# EAGLE design thinks (EAGLE 8.2.2)
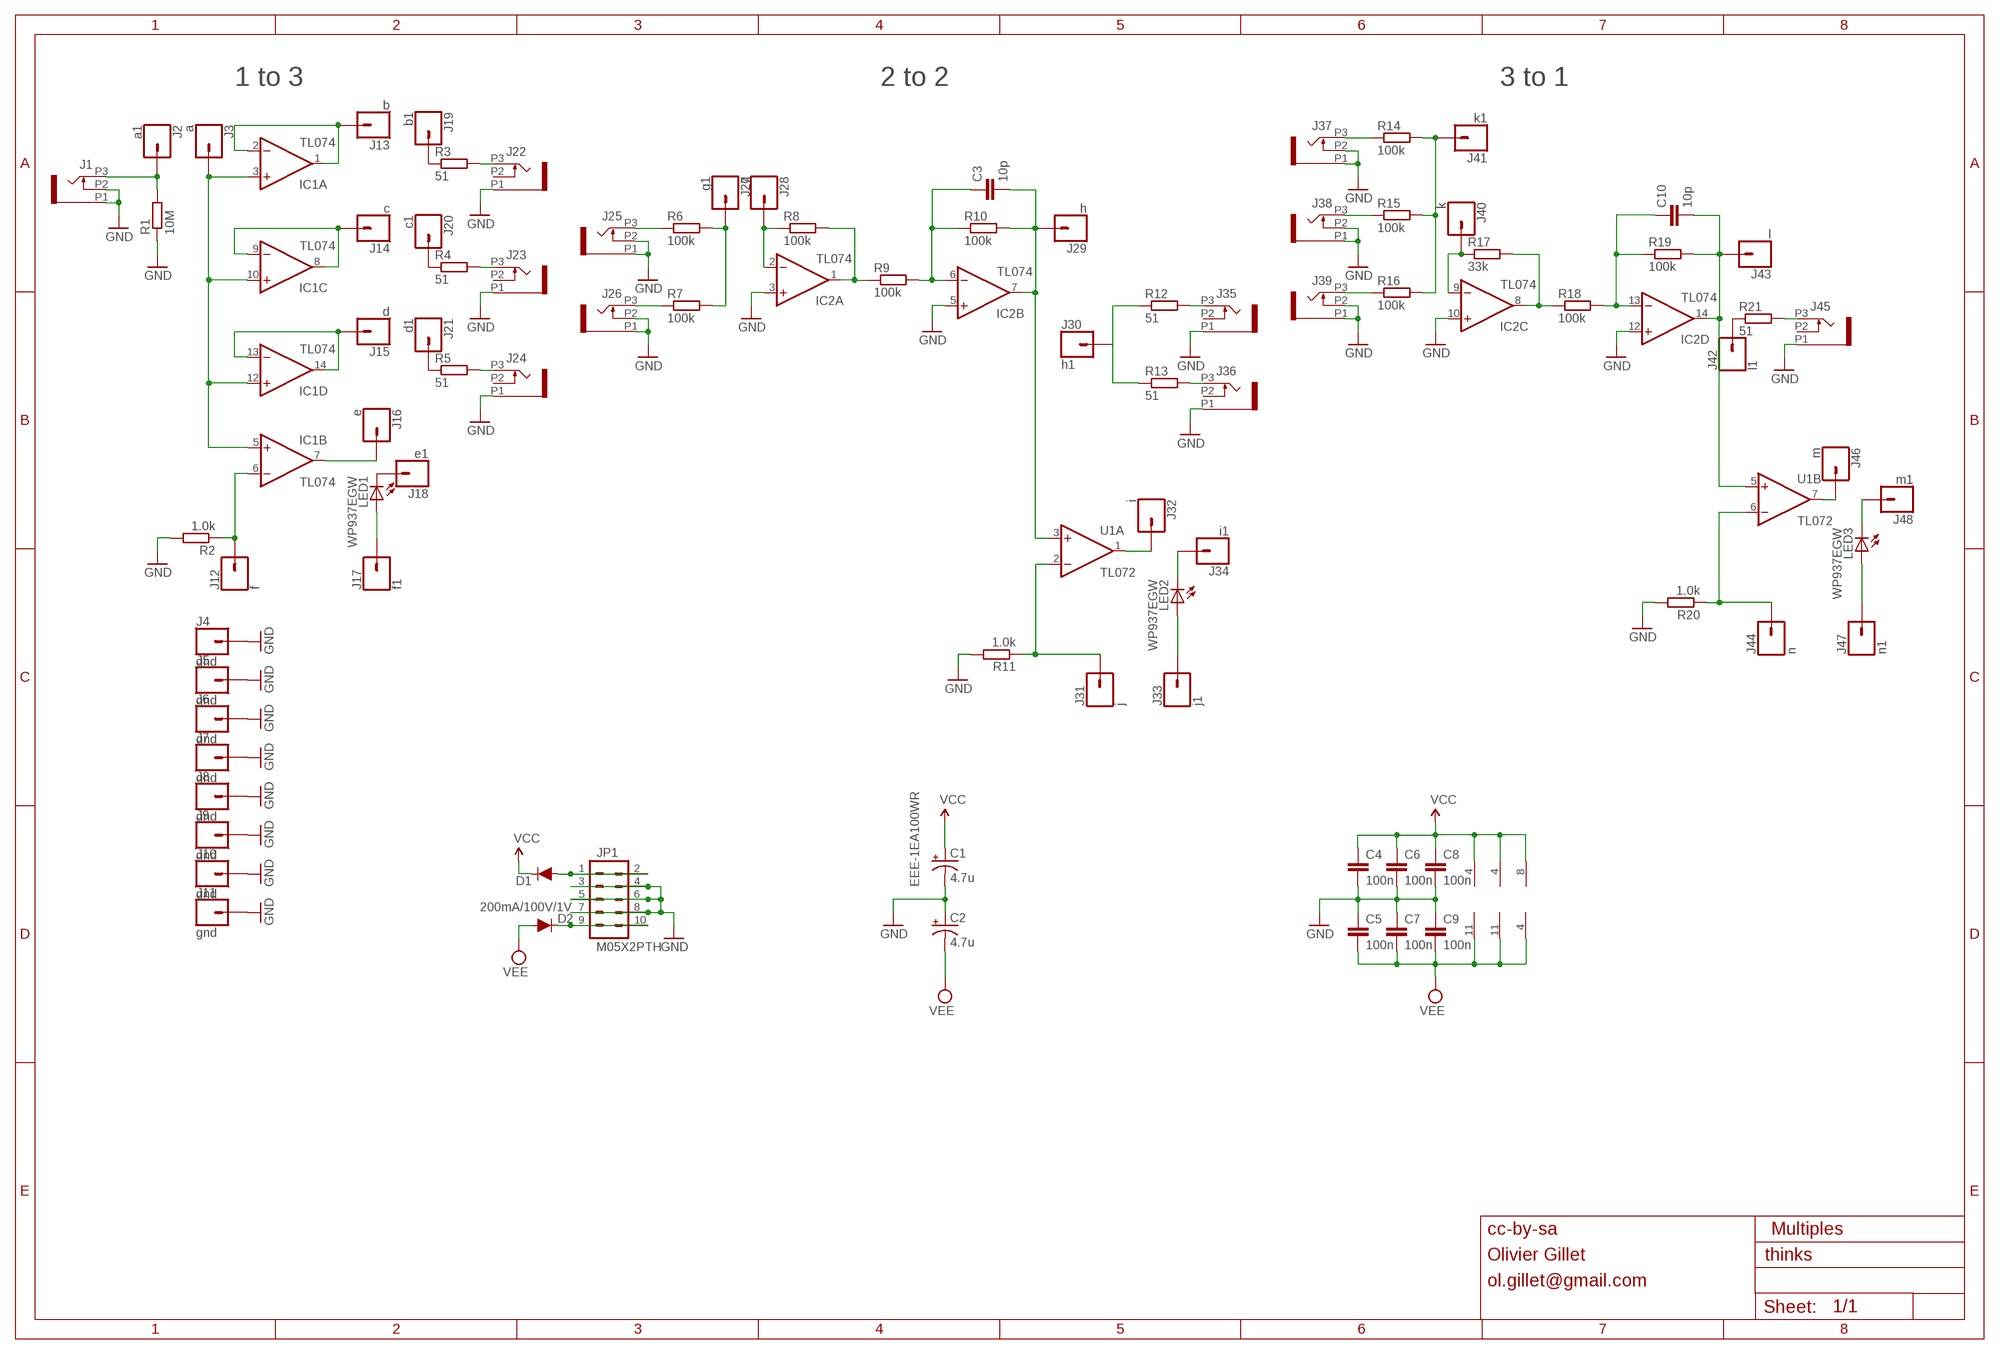
[diagram p0: schematic, sheet 1]

## Parts
C1  4.7u  CPOL-USE2.5-6  [E2,5-6]
C2  4.7u  CPOL-USE2.5-6  [E2,5-6]
C3  10p  C5/2.5  [C5B2.5]
C4  100n  C5/2.5  [C5B2.5]
C5  100n  C5/2.5  [C5B2.5]
C6  100n  C5/2.5  [C5B2.5]
C7  100n  C5/2.5  [C5B2.5]
C8  100n  C5/2.5  [C5B2.5]
C9  100n  C5/2.5  [C5B2.5]
C10  10p  C5/2.5  [C5B2.5]
D1  200mA/100V/1V  DIODE-1N4148  [DIODE-1N4148]
D2  200mA/100V/1V  DIODE-1N4148  [DIODE-1N4148]
IC1  TL074  TL074P  [DIL14]
IC2  TL074  TL074P  [DIL14]
J1  PJ301_THONKICONN6  [WQP_PJ_301M6]
J2  a1  CONN_01  [1X01]
J3  a  CONN_01  [1X01]
J4  gnd  CONN_01  [1X01]
J5  gnd  CONN_01  [1X01]
J6  gnd  CONN_01  [1X01]
J7  gnd  CONN_01  [1X01]
J8  gnd  CONN_01  [1X01]
J9  gnd  CONN_01  [1X01]
J10  gnd  CONN_01  [1X01]
J11  gnd  CONN_01  [1X01]
J12  f  CONN_01  [1X01]
J13  b  CONN_01  [1X01]
J14  c  CONN_01  [1X01]
J15  d  CONN_01  [1X01]
J16  e  CONN_01  [1X01]
J17  f1  CONN_01  [1X01]
J18  e1  CONN_01  [1X01]
J19  b1  CONN_01  [1X01]
J20  c1  CONN_01  [1X01]
J21  d1  CONN_01  [1X01]
J22  PJ301_THONKICONN6  [WQP_PJ_301M6]
J23  PJ301_THONKICONN6  [WQP_PJ_301M6]
J24  PJ301_THONKICONN6  [WQP_PJ_301M6]
J25  PJ301_THONKICONN6  [WQP_PJ_301M6]
J26  PJ301_THONKICONN6  [WQP_PJ_301M6]
J27  g1  CONN_01  [1X01]
J28  g  CONN_01  [1X01]
J29  h  CONN_01  [1X01]
J30  h1  CONN_01  [1X01]
J31  j  CONN_01  [1X01]
J32  i  CONN_01  [1X01]
J33  j1  CONN_01  [1X01]
J34  i1  CONN_01  [1X01]
J35  PJ301_THONKICONN6  [WQP_PJ_301M6]
J36  PJ301_THONKICONN6  [WQP_PJ_301M6]
J37  PJ301_THONKICONN6  [WQP_PJ_301M6]
J38  PJ301_THONKICONN6  [WQP_PJ_301M6]
J39  PJ301_THONKICONN6  [WQP_PJ_301M6]
J40  k  CONN_01  [1X01]
J41  k1  CONN_01  [1X01]
J42  l1  CONN_01  [1X01]
J43  l  CONN_01  [1X01]
J44  n  CONN_01  [1X01]
J45  PJ301_THONKICONN6  [WQP_PJ_301M6]
J46  m  CONN_01  [1X01]
J47  n1  CONN_01  [1X01]
J48  m1  CONN_01  [1X01]
JP1  M05X2PTH  [AVR_ICSP]
LED1  WP937EGW  LED3MM  [LED3MM]
LED2  WP937EGW  LED3MM  [LED3MM]
LED3  WP937EGW  LED3MM  [LED3MM]
R1  10M  RESISTORVERTICAL  [VERTICAL_RESISTOR]
R2  1.0k  RESISTORVERTICAL  [VERTICAL_RESISTOR]
R3  51  RESISTORVERTICAL  [VERTICAL_RESISTOR]
R4  51  RESISTORVERTICAL  [VERTICAL_RESISTOR]
R5  51  RESISTORVERTICAL  [VERTICAL_RESISTOR]
R6  100k  RESISTORVERTICAL  [VERTICAL_RESISTOR]
R7  100k  RESISTORVERTICAL  [VERTICAL_RESISTOR]
R8  100k  RESISTORVERTICAL  [VERTICAL_RESISTOR]
R9  100k  RESISTORVERTICAL  [VERTICAL_RESISTOR]
R10  100k  RESISTORVERTICAL  [VERTICAL_RESISTOR]
R11  1.0k  RESISTORVERTICAL  [VERTICAL_RESISTOR]
R12  51  RESISTORVERTICAL  [VERTICAL_RESISTOR]
R13  51  RESISTORVERTICAL  [VERTICAL_RESISTOR]
R14  100k  RESISTORVERTICAL  [VERTICAL_RESISTOR]
R15  100k  RESISTORVERTICAL  [VERTICAL_RESISTOR]
R16  100k  RESISTORVERTICAL  [VERTICAL_RESISTOR]
R17  33k  RESISTORVERTICAL  [VERTICAL_RESISTOR]
R18  100k  RESISTORVERTICAL  [VERTICAL_RESISTOR]
R19  100k  RESISTORVERTICAL  [VERTICAL_RESISTOR]
R20  1.0k  RESISTORVERTICAL  [VERTICAL_RESISTOR]
R21  51  RESISTORVERTICAL  [VERTICAL_RESISTOR]
U1  TL072  OP_DUAL_  [DIL08]

## Nets
GND: C1.- C2.+ C4.2 C5.1 C6.2 C7.1 C8.2 C9.1 IC2.3(A:+IN) IC2.5(B:+IN) IC2.10(C:+IN) IC2.12(D:+IN) J1.P1 J1.P2 J4.1 J5.1 J6.1 J7.1 J8.1 J9.1 J10.1 J11.1 J22.P1 J23.P1 J24.P1 J25.P1 J25.P2 J26.P1 J26.P2 J35.P1 J36.P1 J37.P1 J37.P2 J38.P1 J38.P2 J39.P1 J39.P2 J45.P1 JP1.3 JP1.4 JP1.5 JP1.6 JP1.7 JP1.8 R1.1 R2.2 R11.2 R20.2
N$1: IC2.1(A:OUT) R8.2 R9.1
N$2: J39.P3 R16.1
N$3: IC1.1(A:OUT) IC1.2(A:-IN) J13.1
N$4: IC1.8(C:OUT) IC1.9(C:-IN) J14.1
N$5: IC1.13(D:-IN) IC1.14(D:OUT) J15.1
N$6: D1.A JP1.1 JP1.2
N$7: IC1.3(A:+IN) IC1.5(B:+IN) IC1.10(C:+IN) IC1.12(D:+IN) J3.1
N$8: IC1.7(B:OUT) J16.1
N$9: J38.P3 R15.1
N$10: J26.P3 R7.1
N$11: J22.P3 R3.2
N$12: J23.P3 R4.2
N$13: J24.P3 R5.2
N$14: J34.1 LED2.K(C)
N$15: J25.P3 R6.1
N$16: J36.P3 R13.2
N$17: J35.P3 R12.2
N$18: C10.2 IC2.14(D:OUT) J43.1 R19.2 U1.5(B:+IN)
N$19: J44.1 R20.1 U1.6(B:-IN)
N$20: D2.C JP1.9 JP1.10
N$21: IC1.6(B:-IN) J12.1 R2.1
N$22: J37.P3 R14.1
N$23: J45.P3 R21.2
N$24: J41.1 R14.2 R15.2 R16.2
N$25: IC2.8(C:OUT) R17.2 R18.1
N$26: C3.2 IC2.7(B:OUT) J29.1 R10.2 U1.3(A:+IN)
N$27: C10.1 IC2.13(D:-IN) R18.2 R19.1
N$28: J1.P3 J2.1 R1.2
N$29: J31.1 R11.1 U1.2(A:-IN)
N$30: J48.1 LED3.K(C)
N$31: J27.1 R6.2 R7.2
N$32: C3.1 IC2.6(B:-IN) R9.2 R10.1
N$33: J19.1 R3.1
N$34: J20.1 R4.1
N$35: J21.1 R5.1
N$36: J17.1 LED1.A
N$37: J18.1 LED1.K(C)
N$38: IC2.2(A:-IN) J28.1 R8.1
N$39: J30.1 R12.1 R13.1
N$40: IC2.9(C:-IN) J40.1 R17.1
N$41: J33.1 LED2.A
N$42: J32.1 U1.1(A:OUT)
N$43: J42.1 R21.1
N$44: J46.1 U1.7(B:OUT)
N$45: J47.1 LED3.A
VCC: C1.+ C4.1 C6.1 C8.1 D1.C IC1.4(P:V+) IC2.4(P:V+) U1.8(P:V+)
VEE: C2.- C5.2 C7.2 C9.2 D2.A IC1.11(P:V-) IC2.11(P:V-) U1.4(P:V-)
Unconnected: J22.P2 J23.P2 J24.P2 J35.P2 J36.P2 J45.P2

## Notes on the sheet
- 1 to 3 | 2 to 2 | 3 to 1
- EEE-1EA100WR
- cc-by-sa | Multiples
- Olivier Gillet
- ol.gillet@gmail.com

## Library data of the parts
C1 C2 = resistor:CPOL-US: POLARIZED CAPACITOR, American symbol
C3-C10 = capacitor-wima:C: CAPACITOR naming: grid - package width
D1 D2 = SparkFun-DiscreteSemi:DIODE: Diode These are standard reverse protection diodes and small signal diodes. SparkFun Products: SparkFun SparkPunk Sound Kit <https://www.sparkfun.com/products/11177> SparkFun ESP8266 Thing <https://www.sparkfun.com/products/13231>; PROD_ID: DIO-08378
IC1 IC2 = linear:TL074: OP AMP
J1 J22-J26 J35-J39 J45 = og-pj301:PJ301_THONKICONN
J2-J21 J27-J34 J40-J44 J46-J48 = SparkFun-Connectors:CONN_01: Single connection point. Often used as Generic Header-pin footprint for 0.1 inch spaced/style header connections On any of the 0.1 inch spaced packages, you can populate with these: Break Away Headers - Straight <https://www.sparkfun.com/products/116> (PRT-00116) Break Away Male Headers - Right Angle <https://www.sparkfun.com/products/553> (PRT-00553) Female Headers <https://www.sparkfun.com/products/115> (PRT-00115) Break Away Headers - Machine Pin <https://www.sparkfun.com/products/117> (PRT-00117) Break Away Female Headers - Swiss Machine Pin <https://www.sparkfun.com/products/743> (PRT-00743) This device is also useful as a general connection point to wire up your design to another part of your project. Our various solder wires solder well into these plated through hole pads. Hook-Up Wire - Assortment (Stranded, 22 AWG) <https://www.sparkfun.com/products/11375> (PRT-11375) Hook-Up Wire - Assortment (Solid Core, 22 AWG) <https://www.sparkfun.com/products/11367> (PRT-11367) View the entire wire category on our website here <https://www.sparkfun.com/categories/141> Special notes: SMTSO-256-ET is a "flush mount" nut for a 4-40 screw. We mostly use this on specialty testbeds; it is a nice way to connect hardware to your PCB at an adjustable hieght. Also note, the SNAP packages are for using a snappable style connector. We sell a baggie of snaps and they are also used on two LilyPad designs: Snap Assortment - 30 pack (male and female) <https://www.sparkfun.com/products/11347> (DEV-11347) LilyPad Arduino SimpleSnap <https://www.sparkfun.com/products/10941> (DEV-10941) LilyPad SimpleSnap Protoboard <https://www.sparkfun.com/products/10940> (DEV-10940)
JP1 = og-header:M05X2: Header 5x2 Standard 10-pin dual row 0.1" header. Commonly used with AVR-ISP. Use with Spark Fun Electronics SKU: PRT-00778
LED1-LED3 = led:LED: LED OSRAM: - CHIPLED LG R971, LG N971, LY N971, LG Q971, LY Q971, LO R971, LY R971 LH N974, LH R974 LS Q976, LO Q976, LY Q976 LO Q996 - Hyper CHIPLED LW Q18S LB Q993, LB Q99A, LB R99A - SideLED LS A670, LO A670, LY A670, LG A670, LP A670 LB A673, LV A673, LT A673, LW A673 LH A674 LY A675 LS A676, LA A676, LO A676, LY A676, LW A676 LS A679, LY A679, LG A679 - Hyper Micro SIDELED® LS Y876, LA Y876, LO Y876, LY Y876 LT Y87S - SmartLED LW L88C, LW L88S LB L89C, LB L89S, LG L890 LS L89K, LO L89K, LY L89K LS L896, LA L896, LO L896, LY L896 - TOPLED LS T670, LO T670, LY T670, LG T670, LP T670 LSG T670, LSP T670, LSY T670, LOP T670, LYG T670 LG T671, LOG T671, LSG T671 LB T673, LV T673, LT T673, LW T673 LH T674 LS T676, LA T676, LO T676, LY T676, LB T676, LH T676, LSB T676, LW T676 LB T67C, LV T67C, LT T67C, LS T67K, LO T67K, LY T67K, LW E67C LS E67B, LA E67B, LO E67B, LY E67B, LB E67C, LV E67C, LT E67C LW T67C LS T679, LY T679, LG T679 LS T770, LO T770, LY T770, LG T770, LP T770 LB T773, LV T773, LT T773, LW T773 LH T774 LS E675, LA E675, LY E675, LS T675 LS T776, LA T776, LO T776, LY T776, LB T776 LHGB T686 LT T68C, LB T68C - Hyper Mini TOPLED® LB M676 - Mini TOPLED Santana® LG M470 LS M47K, LO M47K, LY M47K Source: http://www.osram.convergy.de LUXEON: - LUMILED® LXK2-PW12-R00, LXK2-PW12-S00, LXK2-PW14-U00, LXK2-PW14-V00 LXK2-PM12-R00, LXK2-PM12-S00, LXK2-PM14-U00 LXK2-PE12-Q00, LXK2-PE12-R00, LXK2-PE12-S00, LXK2-PE14-T00, LXK2-PE14-U00 LXK2-PB12-K00, LXK2-PB12-L00, LXK2-PB12-M00, LXK2-PB14-N00, LXK2-PB14-P00, LXK2-PB14-Q00 LXK2-PR12-L00, LXK2-PR12-M00, LXK2-PR14-Q00, LXK2-PR14-R00 LXK2-PD12-Q00, LXK2-PD12-R00, LXK2-PD12-S00 LXK2-PH12-R00, LXK2-PH12-S00 LXK2-PL12-P00, LXK2-PL12-Q00, LXK2-PL12-R00 Source: www.luxeon.com KINGBRIGHT: KA-3528ASYC Source: www.kingbright.com
R1-R21 = kweiwen:*RESISTOR*: Standard resistor, various versions
U1 = kweiwen:OP_DUAL: Generic Dual Op Amp

## Net classes
0 default: width 0.305 mm

## Board
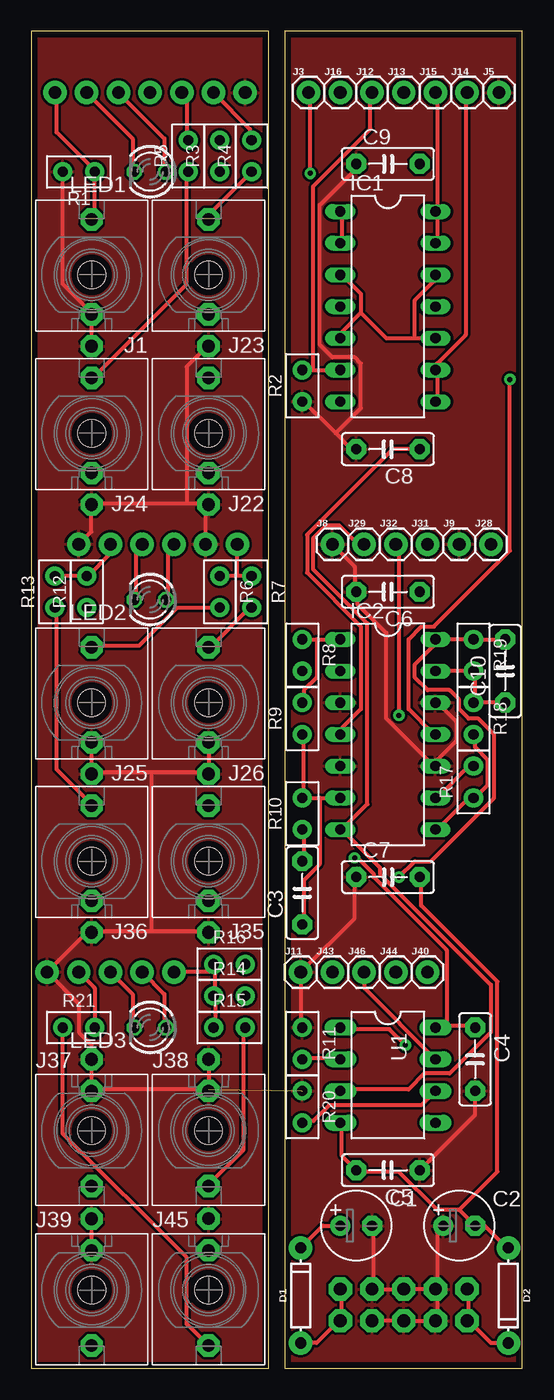
[diagram p1: board, top side]
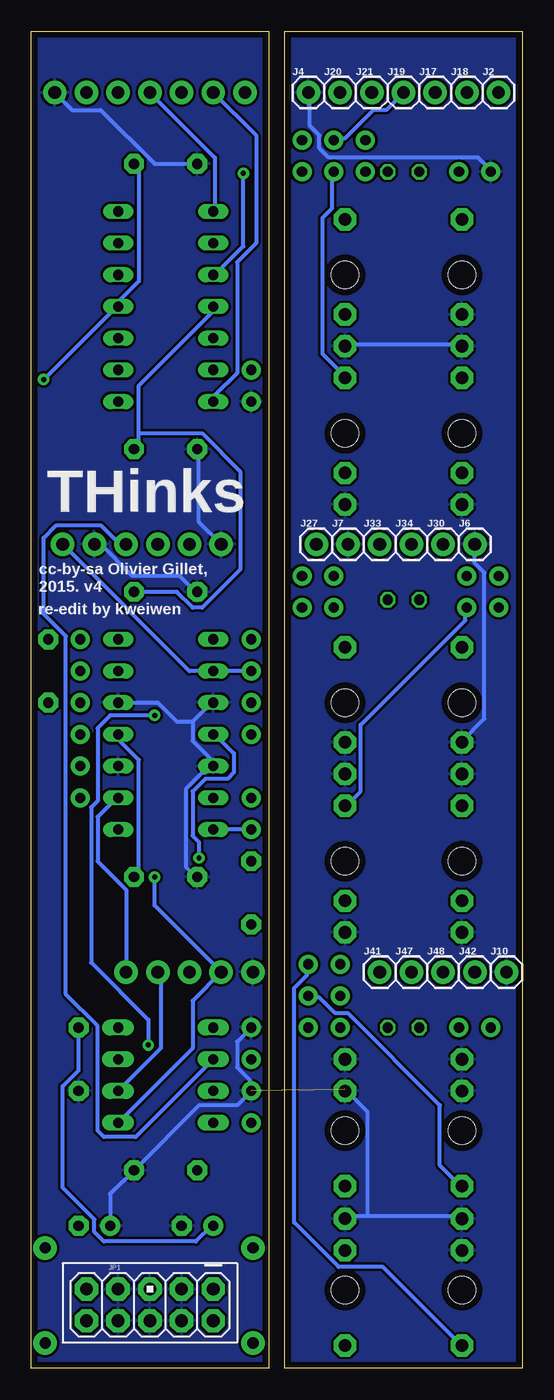
[diagram p2: board, bottom side, seen from below]

Size 39.35 x 107.16 mm. Coordinates in mm from the lower left corner, seen from the top.
Outline: 0,0 19.03,0 19.03,107.16 0,107.16 0,0
Outline: 39.35,0 39.35,107.16 20.32,107.16 20.32,0 39.35,0
Copper layers (1*16): Top 0.035mm / dielectric 1.5mm / Bottom 0.035mm
Design rules "PCBCart-Standard *": minimum track width 8mil, minimum drill 0.4mm, track to track 8mil, track to pad 8mil, pad to pad 8mil, via to via 8mil, smd to smd 8mil, copper to edge 20mil, drill to drill 8mil, minimum pad ring 8mil, minimum via ring 10mil, stop-mask expansion 3mil, vias tented up to drill 25mil, thermal gap 8mil

### Footprints (pad centres in the part's own frame; a part is rotated, then mirrored left to right if it is on the bottom)
E2,5-6 = drill 0.813 pad 1.6: + -1.27,0 | drill 0.813 pad 1.6 octagon: - 1.27,0
C5B2.5 = drill 0.813 pad 1.6 octagon: 1 -2.54,0; 2 2.54,0
DIODE-1N4148 = drill 0.9 pad 1.88: A -3.81,0; C 3.81,0
DIL14 = drill 0.813 long: 1 -7.62,-3.81; 2 -5.08,-3.81; 3 -2.54,-3.81; 4 0,-3.81; 5 2.54,-3.81; 6 5.08,-3.81; 7 7.62,-3.81; 8 7.62,3.81; 9 5.08,3.81; 10 2.54,3.81; 11 0,3.81; 12 -2.54,3.81; 13 -5.08,3.81; 14 -7.62,3.81
WQP_PJ_301M6 = drill 1.016 pad 1.778 octagon: P1 0,-5.715; P2 0,-3.175; P3 0,4.445 | hole 2.2: 0,0
1X01 = drill 1.016 pad 1.88: 1 0,0
AVR_ICSP = drill 1.016 pad 1.88 octagon: 1 -1.27,5.08; 2 1.27,5.08; 3 -1.27,2.54; 4 1.27,2.54; 5 -1.27,0; 6 1.27,0; 7 -1.27,-2.54; 8 1.27,-2.54; 9 -1.27,-5.08; 10 1.27,-5.08
LED3MM = drill 0.813 octagon: A -1.27,0; K 1.27,0
VERTICAL_RESISTOR = drill 0.813 pad 1.524: 1 -1.27,0; 2 1.27,0
DIL08 = drill 0.813 pad 1.27 long: 1 -3.81,-3.81; 2 -1.27,-3.81; 3 1.27,-3.81; 4 3.81,-3.81; 5 3.81,3.81; 6 1.27,3.81; 7 -1.27,3.81; 8 -3.81,3.81

### Placement (x,y rotation side)
C1  26.04,11.43 0 top
C2  34.29,11.43 0 top
C3  21.72,38.1 90 top
C4  35.56,24.77 270 top
C5  28.57,15.88 180 top
C6  28.57,62.23 180 top
C7  28.57,39.37 0 top
C8  28.57,73.66 180 top
C9  28.57,96.52 0 top
C10  37.97,55.88 90 top
D1  21.59,5.84 90 top
D2  38.23,5.84 270 top
IC1  28.57,85.09 270 top
IC2  28.57,50.8 270 top
J1  4.84,87.63 0 top
J2  1.91,102.23 0 bottom
J3  22.23,102.23 0 top
J4  17.14,102.23 0 bottom
J5  37.47,102.23 0 top
J6  3.81,66.04 0 bottom
J7  13.97,66.04 0 bottom
J8  24.13,66.04 0 top
J9  34.29,66.04 0 top
J10  1.27,31.75 0 bottom
J11  21.59,31.75 0 top
J12  27.3,102.23 0 top
J13  29.84,102.23 0 top
J14  34.92,102.23 0 top
J15  32.38,102.23 0 top
J16  24.77,102.23 0 top
J17  6.99,102.23 0 bottom
J18  4.45,102.23 0 bottom
J19  9.53,102.23 0 bottom
J20  14.61,102.23 0 bottom
J21  12.06,102.23 0 bottom
J22  14.21,74.93 0 top
J23  14.21,87.63 0 top
J24  4.84,74.93 0 top
J25  4.84,53.34 0 top
J26  14.21,53.34 0 top
J27  16.51,66.04 0 bottom
J28  36.83,66.04 0 top
J29  26.67,66.04 0 top
J30  6.35,66.04 0 bottom
J31  31.75,66.04 0 top
J32  29.21,66.04 0 top
J33  11.43,66.04 0 bottom
J34  8.89,66.04 0 bottom
J35  14.21,40.64 0 top
J36  4.84,40.64 0 top
J37  4.84,19.05 180 top
J38  14.21,19.05 180 top
J39  4.84,6.27 180 top
J40  31.75,31.75 0 top
J41  11.43,31.75 0 bottom
J42  3.81,31.75 0 bottom
J43  24.13,31.75 0 top
J44  29.21,31.75 0 top
J45  14.21,6.27 180 top
J46  26.67,31.75 0 top
J47  8.89,31.75 0 bottom
J48  6.35,31.75 0 bottom
JP1  29.84,5.08 270 bottom
LED1  9.53,95.89 180 top
LED2  9.53,61.59 180 top
LED3  9.53,27.3 180 top
R1  3.81,95.89 0 top
R2  21.72,78.74 270 top
R3  15.11,97.16 270 top
R4  17.65,97.16 270 top
R5  12.57,97.16 270 top
R6  15.11,62.23 90 top
R7  17.65,62.23 90 top
R8  21.72,57.15 90 top
R9  21.72,52.07 270 top
R10  21.72,44.45 270 top
R11  21.72,26.04 90 top
R12  4.45,62.23 270 top
R13  1.91,62.23 270 top
R14  15.88,29.84 180 top
R15  15.88,27.3 180 top
R16  15.88,32.38 180 top
R17  35.43,46.99 270 top
R18  35.43,52.07 90 top
R19  35.43,57.15 90 top
R20  21.72,20.95 90 top
R21  3.81,27.3 180 top
U1  28.57,23.5 270 top

### Tracks (layer width: path | path; a pad name or v marks a point on that pad's centre or on a via)
GND  (1 unrouted)
  Top 0.305: J7.1 13.97,69.09 J22.P1 13.97,69.34 12.45,69.34 | J6.1 4.83,67.06 4.83,69.09 J24.P1 5.08,69.34 12.45,69.34 | R1.1 2.54,86.87 4.83,84.58 J1.P2 4.83,84.33 4.83,82.04 J1.P1 | 12.45,69.34 12.45,80.26 13.97,81.79 J23.P1 | J39.P2 4.83,9.65 4.83,11.94 J39.P1 | J38.P1 14.22,24.64 14.22,22.35 J38.P2 13.97,22.35 5.08,22.35 J37.P2 4.83,22.35 4.83,24.64 J37.P1 4.83,24.89 4.83,25.91 3.81,26.92 3.81,29.21 J10.1 4.32,34.8 4.83,34.8 J36.P1 5.08,35.05 9.65,35.05 | J25.P2 4.83,50.04 4.83,47.75 J25.P1 5.08,47.75 9.65,47.75 | J26.P2 14.22,50.04 14.22,47.75 J26.P1 13.97,47.75 9.65,47.75 | 9.65,35.05 13.97,35.05 J35.P1 | 9.65,35.05 9.65,47.75 | 24.38,74.93 25.65,73.66 C8.2 | 24.38,74.93 21.84,77.47 R2.2 | J8.1 25.91,64.26 25.91,62.23 C6.2 26.16,62.23 26.16,61.21 28.45,58.93 28.45,52.07 32.26,48.26 IC2.10 32.51,48.26 32.51,48.77 34.04,50.29 34.04,51.82 32.51,53.34 IC2.12 | 24.38,74.93 26.42,76.96 26.42,80.52 25.91,81.03 24.13,81.03 23.11,82.04 23.11,93.22 25.91,96.01 25.91,96.52 C9.1 | JP1.4 JP1.6 JP1.8 32.51,3.81 32.51,6.35 | 27.43,6.35 27.43,11.43 C1.- | 27.43,6.35 JP1.5 JP1.7 32.51,6.35 | 27.43,6.35 JP1.3 | C4.2 35.56,20.32 C5.1 | 32.51,6.35 32.51,10.92 C2.+ | C7.1 25.91,39.37 25.91,36.07 J11.1 21.59,27.43 R11.2
  Bottom 0.305: J23.P1 13.97,82.04 5.08,82.04 J1.P1 | J4.1 17.02,102.11 17.02,99.57 16.26,98.81 16.26,97.79 15.49,97.03 3.56,97.03 2.54,96.01 R1.1 | 12.45,12.19 5.08,12.19 J39.P1 | 12.45,12.19 13.97,12.19 J45.P1 | 12.45,12.19 12.45,20.57 13.97,22.1 J38.P2 | J6.1 3.81,64.52 3.05,63.75 3.05,52.07 4.83,50.29 J25.P2 | C9.1 29.46,96.52 33.78,100.84 36.07,100.84 J5.1 | J9.1 33.78,66.04 31.24,63.5 27.43,63.5 26.16,62.23 C6.2 | J8.1 25.91,67.82 25.91,73.66 C8.2 | C2.+ 33.02,13.97 C5.1 25.91,21.08 22.86,21.08 R20.2 21.84,22.35 21.84,23.11 22.86,24.13 22.86,26.16 R11.2 | 24.89,48.26 24.89,48.77 26.42,50.29 26.42,51.82 | 26.42,51.82 24.89,53.34 IC2.3 | 26.42,51.82 27.69,51.82 29.21,53.34 IC2.12 | 24.89,48.26 25.4,47.75 25.65,47.75 26.92,46.48 26.92,40.13 26.16,39.37 C7.1 | 24.89,48.26 IC2.5
  pour Bottom: 0,0 19.05,0 19.05,107.31 0,107.31
  pour Top: 0,0 19.05,0 19.05,107.31 0,107.31
  pour Top: 20.32,0 39.37,0 39.37,107.31 20.32,107.31
  pour Bottom: 20.32,0 39.37,0 39.37,107.31 20.32,107.31
N$1
  Top 0.305: R8.2 22.86,58.42 | 22.86,58.42 IC2.1 | 22.86,58.42 22.86,55.37 21.84,54.36 21.84,53.34 R9.1
N$2
  Bottom 0.305: R16.1 17.27,32.26 17.27,31.5 18.29,30.48 18.29,11.68 14.73,8.13 11.18,8.13 5.08,2.03 J39.P3
N$3
  Top 0.305: IC1.2 24.89,90.17 24.89,92.71 IC1.1
  Bottom 0.305: J13.1 24.64,97.03 24.64,92.71 IC1.1
N$4
  Top 0.305: 32.51,80.01 32.51,77.47 IC1.8 | 32.51,80.01 32.51,80.52 34.8,82.8 34.8,102.11 J14.1 | 32.51,80.01 IC1.9
N$5
  Top 0.305: 32.51,92.71 32.51,90.17 IC1.13 | 32.51,92.71 32.51,102.11 J15.1 | 32.51,92.71 IC1.14
N$6
  Top 0.305: D1.A 22.86,2.03 24.64,3.81 JP1.2 24.89,3.81 24.89,6.35 JP1.1
N$7  (via drill 0.4)
  Top 0.305: 26.42,84.58 24.89,83.06 24.89,82.55 IC1.5 | 26.42,84.58 26.42,86.11 24.89,87.63 IC1.3 | 30.73,82.55 28.45,82.55 26.42,84.58 | 30.73,82.55 IC1.10 | 30.73,82.55 30.73,85.6 32.26,87.12 32.26,87.63 IC1.12 | v22.35,95.76 22.35,102.11 J3.1
  Bottom 0.305: v22.35,95.76 22.35,89.92 24.64,87.63 IC1.3
N$8
  Bottom 0.305: J16.1 21.34,98.81 21.34,90.17 22.86,88.65 22.86,79.76 24.64,77.98 24.64,77.47 IC1.7
N$9
  Top 0.305: R15.1 17.02,27.18 17.02,17.53 14.22,14.73 J38.P3
N$10
  Top 0.305: R7.1 17.53,60.96 14.22,57.66 J26.P3
N$11
  Bottom 0.305: R3.2 15.24,95.76 15.24,92.96 16,92.2 16,81.28 14.22,79.5 J22.P3
N$12
  Top 0.305: R4.2 13.97,92.2 J23.P3
N$13
  Top 0.305: R5.2 12.45,95.76 12.45,86.87 5.08,79.5 J24.P3
N$14
  Top 0.305: J34.1 8.38,65.53 8.38,61.72 LED2.K
N$15
  Top 0.305: R6.1 11.68,60.96 8.64,57.91 5.08,57.91 J25.P3
N$16
  Top 0.305: R13.2 2.03,60.96 2.03,48.01 4.83,45.21 J36.P3
N$17
  Bottom 0.305: R12.2 4.57,60.96 4.57,59.94 12.95,51.56 12.95,46.23 13.97,45.21 J35.P3
N$18  (via drill 0.4)
  Top 0.305: C10.2 R19.2 IC2.14 32.26,58.42 32.26,57.91 30.73,56.39 30.73,55.37 31.75,54.36 33.53,54.36 34.29,53.59 34.29,52.83 35.05,52.07 35.81,52.07 37.08,50.8 37.08,45.72 32,40.64 30.73,40.64 v29.46,39.37
  Bottom 0.305: U1.5 26.42,25.65 26.42,29.46 J43.1 29.46,37.08 v29.46,39.37
N$19
  Top 0.305: U1.6 31.24,21.08 23.88,21.08 22.61,19.81 21.84,19.81 R20.1
  Bottom 0.305: U1.6 28.96,25.65 28.96,31.5 J44.1
N$20
  Top 0.305: D2.C 36.83,2.03 35.05,3.81 | 35.05,3.81 35.05,6.35 JP1.9 | 35.05,3.81 JP1.10
N$21
  Top 0.305: R2.1 22.61,80.01 | 22.61,80.01 IC1.6 | 22.61,80.01 22.61,94.74 27.18,99.31 27.18,102.11 J12.1
N$22
  Bottom 0.305: R14.1 17.02,29.72 16.26,29.72 14.99,28.45 13.97,28.45 6.6,21.08 6.6,16.26 5.08,14.73 J37.P3
N$23
  Top 0.305: R21.2 2.54,18.8 12.45,8.89 12.45,3.56 13.97,2.03 J45.P3
N$24
  Top 0.305: R15.2 14.73,27.43 14.73,29.72 R14.2 14.73,29.97 14.73,31.75 | 14.73,31.75 14.73,32.26 R16.2 14.73,31.75 | 14.73,31.75 J41.1
N$25
  Top 0.305: IC2.8 32.51,43.18 35.05,45.72 R17.2 35.56,45.72 36.58,46.74 36.58,48.77 35.56,49.78 35.56,50.8 R18.1
N$26
  Top 0.305: 24.89,43.18 27.94,40.13 27.94,39.62 36.83,30.73 36.83,26.92 33.53,23.62 31.5,23.62 30.23,22.35 24.89,22.35 U1.3 | C3.2 21.84,40.64 21.84,43.18 R10.2 | J29.1 26.16,66.04 24.64,67.56 23.62,67.56 22.61,66.55 22.61,64.01 26.92,59.69 26.92,45.21 24.89,43.18 | 24.89,43.18 IC2.7
  Bottom 0.305: R10.2 IC2.7
N$27
  Top 0.305: IC2.13 R19.1 35.56,55.88 35.56,53.34 | C10.1 35.56,53.34 | 35.56,53.34 R18.2
N$28
  Top 0.305: J1.P3 5.08,92.2 R1.2 5.08,96.01 2.03,99.06 2.03,102.11 J2.1
N$29
  Top 0.305: U1.2 24.64,24.89 21.84,24.89 R11.1
  Bottom 0.305: J31.1 32.26,66.04 33.78,67.56 37.34,67.56 38.35,66.55 38.35,60.45 36.58,58.67 36.58,29.97 34.04,27.43 34.04,19.05 33.53,18.54 30.99,18.54 U1.2
N$30
  Top 0.305: J48.1 8.13,29.97 8.13,27.43 LED3.K
N$31
  Top 0.305: R7.2 16.51,63.5 | 16.51,63.5 R6.2 | 16.51,63.5 J27.1
N$32
  Top 0.305: 21.84,45.72 23.11,45.72 | 23.11,45.72 IC2.6 | 21.84,45.72 21.84,50.8 R9.2 | 21.84,45.72 R10.1 | 23.11,45.72 23.11,40.39 21.84,39.12 21.84,35.56 C3.1
N$33
  Bottom 0.305: J19.1 10.92,100.84 11.94,100.84 14.22,98.55 14.99,98.55 R3.1
N$34
  Top 0.305: J20.1 17.53,99.31 17.53,98.55 R4.1
N$35
  Top 0.305: J21.1 12.45,101.85 12.45,98.55 R5.1
N$36
  Top 0.305: J17.1 10.67,98.55 10.67,96.01 LED1.A
N$37
  Top 0.305: J18.1 8.13,98.55 8.13,96.01 LED1.K
N$38
  Bottom 0.305: R8.1 IC2.2 26.67,55.88 J28.1
N$39
  Top 0.305: R13.1 R12.1 4.57,63.5 6.35,65.28 J30.1
N$40
  Top 0.305: R17.1 35.05,48.26 32.51,45.72 IC2.9
  Bottom 0.305: J40.1 31.75,38.35 34.04,40.64 34.04,44.2 32.51,45.72 IC2.9
N$41
  Top 0.305: J33.1 10.92,65.53 10.92,61.72 LED2.A
N$42  (via drill 0.4)
  Top 0.305: v29.97,25.91 28.7,27.18 24.89,27.18 U1.1 | v29.46,52.32 29.46,65.79 J32.1
  Bottom 0.305: v29.97,25.91 29.97,27.94 34.54,32.51 34.54,44.96 34.04,45.47 34.04,51.31 33.02,52.32 v29.46,52.32
N$43
  Top 0.305: R21.1 5.08,30.48 J42.1
N$44
  Top 0.305: U1.7 26.67,30.48 J46.1
N$45
  Top 0.305: J47.1 10.67,29.97 10.67,27.43 LED3.A
VCC  (via drill 0.4)
  Top 0.305: 33.27,27.43 35.56,27.43 C4.1 | 33.27,27.43 32.51,27.43 U1.8 33.27,27.43 | C1.+ 23.37,11.43 D1.C | C8.1 28.96,73.66 22.1,66.8 22.1,63.75 26.42,59.44 26.42,52.83 24.89,51.31 24.89,50.8 IC2.4 | 33.27,27.43 33.27,33.53 27.43,39.37 27.43,39.62 26.16,40.89 v25.91,40.89
  Bottom 0.305: C4.1 35.56,23.88 36.83,22.61 36.83,14.48 34.29,11.94 34.29,10.92 33.53,10.16 26.16,10.16 24.89,11.43 C1.+ | 30.73,74.93 30.73,73.91 30.99,73.66 C8.1 | 30.73,74.93 30.73,78.74 24.89,84.58 24.89,85.09 IC1.4 | C6.1 27.69,62.23 26.42,60.96 25.65,60.96 22.61,64.01 22.61,71.88 25.65,74.93 30.73,74.93 | v25.91,40.89 25.91,42.16 26.42,42.67 26.42,46.23 25.4,47.24 23.62,47.24 23.11,47.75 23.11,49.28 24.64,50.8 IC2.4
VEE  (via drill 0.4)
  Top 0.305: U1.4 24.89,19.56 24.89,17.02 C5.2 26.16,15.75 29.46,15.75 32.51,12.7 34.29,12.7 | D2.A 38.1,9.65 36.32,11.43 C2.- 34.29,12.7 | 34.29,12.7 37.34,15.75 37.34,30.99 31.24,37.08 31.24,39.37 C7.2 | v38.35,79.25 38.35,65.53 32.26,59.44 31.24,59.44 30.23,58.42 30.23,52.83 32.26,50.8 IC2.11
  Bottom 0.305: C9.2 30.99,96.52 30.73,96.27 30.73,87.12 32.26,85.6 32.26,85.09 IC1.11 32.51,85.09 v38.35,79.25 | IC2.11 32.26,50.8 32.26,50.29 30.73,48.77 30.73,39.62 30.99,39.37 C7.2

### Text on the board
bPlace: THinks | cc-by-sa Olivier Gillet, / 2015. v4 | re-edit by kweiwen